# EAGLE design SPI_CAN_Converter (EAGLE 9.6.2)
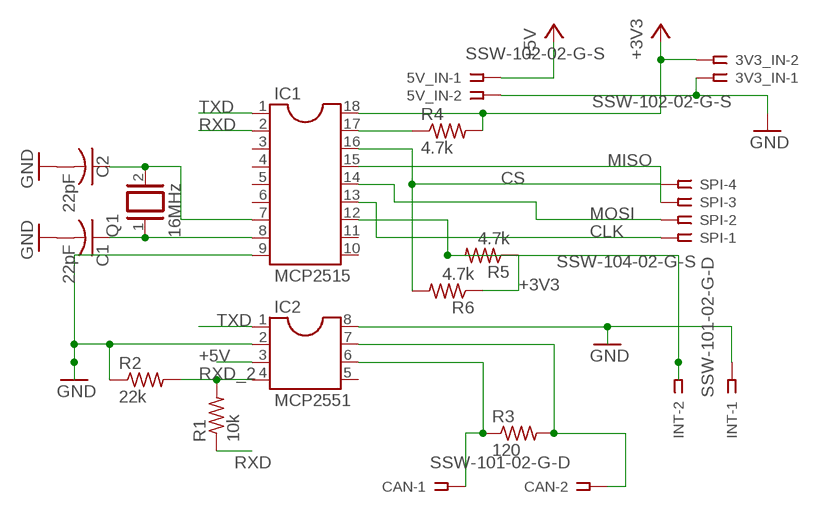
[diagram p0: schematic, sheet 1]

## Parts
3V3_IN  SSW-102-02-G-S  [SSW-102-02-G-S]
5V_IN  SSW-102-02-G-S  [SSW-102-02-G-S]
C1  22pF  C-US050-024X044  [C050-024X044]
C2  22pF  C-US050-024X044  [C050-024X044]
CAN  SSW-101-02-G-D  [SSW-101-02-G-D]
IC1  MCP2515  DIL18  [DIL18]
IC2  MCP2551  DIL8  [DIL08]
INT  SSW-101-02-G-D  [SSW-101-02-G-D]
Q1  16MHz  XTAL/S  [QS]
R1  10k  R-US_0207/7  [0207/7]
R2  22k  R-US_0207/7  [0207/7]
R3  120  R-US_0207/7  [0207/7]
R4  4.7k  R-US_0207/7  [0207/7]
R5  4.7k  R-US_0207/7  [0207/7]
R6  4.7k  R-US_0207/7  [0207/7]
SPI  SSW-104-02-G-S  [SSW-104-02-G-S]

## Nets
+3V3: 3V3_IN.2 IC1.18 R4.2 R5.1 R6.1
+5V: 5V_IN.1 IC2.3
CLK: IC1.13 SPI.1
CS: IC1.16 R6.2 SPI.4
GND: 3V3_IN.1 5V_IN.2 C1.2 C2.2 IC1.9 IC2.2 IC2.8 INT.1 R2.1
INT: IC1.12 INT.2 R5.2
MISO: IC1.15 SPI.3
MOSI: IC1.14 SPI.2
N$1: CAN.2 IC2.7 R3.2
N$2: CAN.1 IC2.6 R3.1
N$3: C1.1 IC1.8 Q1.1
N$4: C2.1 IC1.7 Q1.2
N$6: IC1.17 R4.1
RXD: IC1.2 R1.1
RXD_2: IC2.4 R1.2 R2.2
TXD: IC1.1 IC2.1
Unconnected: IC1.3 IC1.4 IC1.5 IC1.6 IC1.10 IC1.11 IC2.5

## Library data of the parts
3V3_IN 5V_IN = con-samtec:SSW-102-02-G-S: THROUGH-HOLE .025" SQ POST SOCKET Source: Samtec SSW.pdf; MF: Samtec Inc.; MPN: SSW-102-02-G-S; OC_FARNELL: unknown; OC_NEWARK: 11P9351
C1 C2 = rcl:C-US: CAPACITOR, American symbol; SPICEPREFIX: C
CAN INT = con-samtec:SSW-101-02-G: THROUGH-HOLE .025" SQ POST SOCKET Source: Samtec SSW.pdf; MF: Samtec Inc.; MPN: SSW-101-02-G-D; OC_FARNELL: unknown; OC_NEWARK: 82P1456
IC1 = ic-package:DIL18: Dual In Line / Socket
IC2 = ic-package:DIL8: Dual In Line / Socket
Q1 = special:XTAL/S: CRYSTAL
R1-R6 = rcl:R-US_: RESISTOR, American symbol; SPICEPREFIX: R
SPI = con-samtec:SSW-104-02-G-S: THROUGH-HOLE .025" SQ POST SOCKET Source: Samtec SSW.pdf; MF: Samtec Inc.; MPN: SSW-104-02-G-S; OC_FARNELL: unknown; OC_NEWARK: 11P9384

## Board
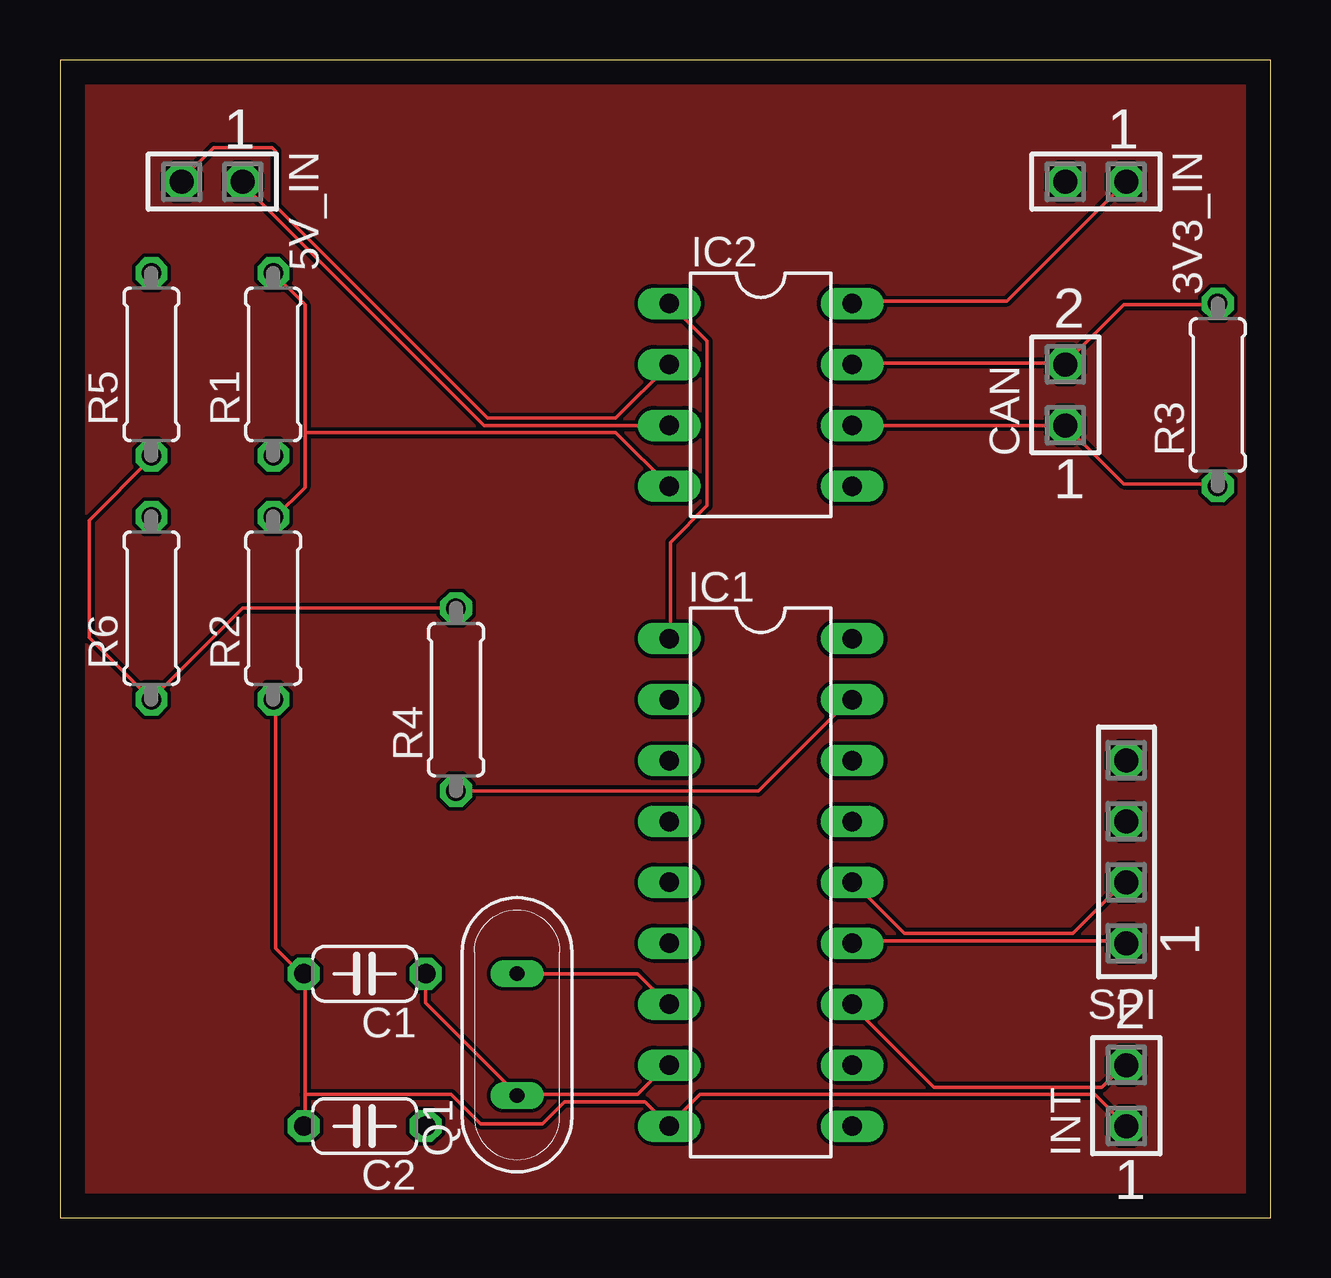
[diagram p1: board, top side]
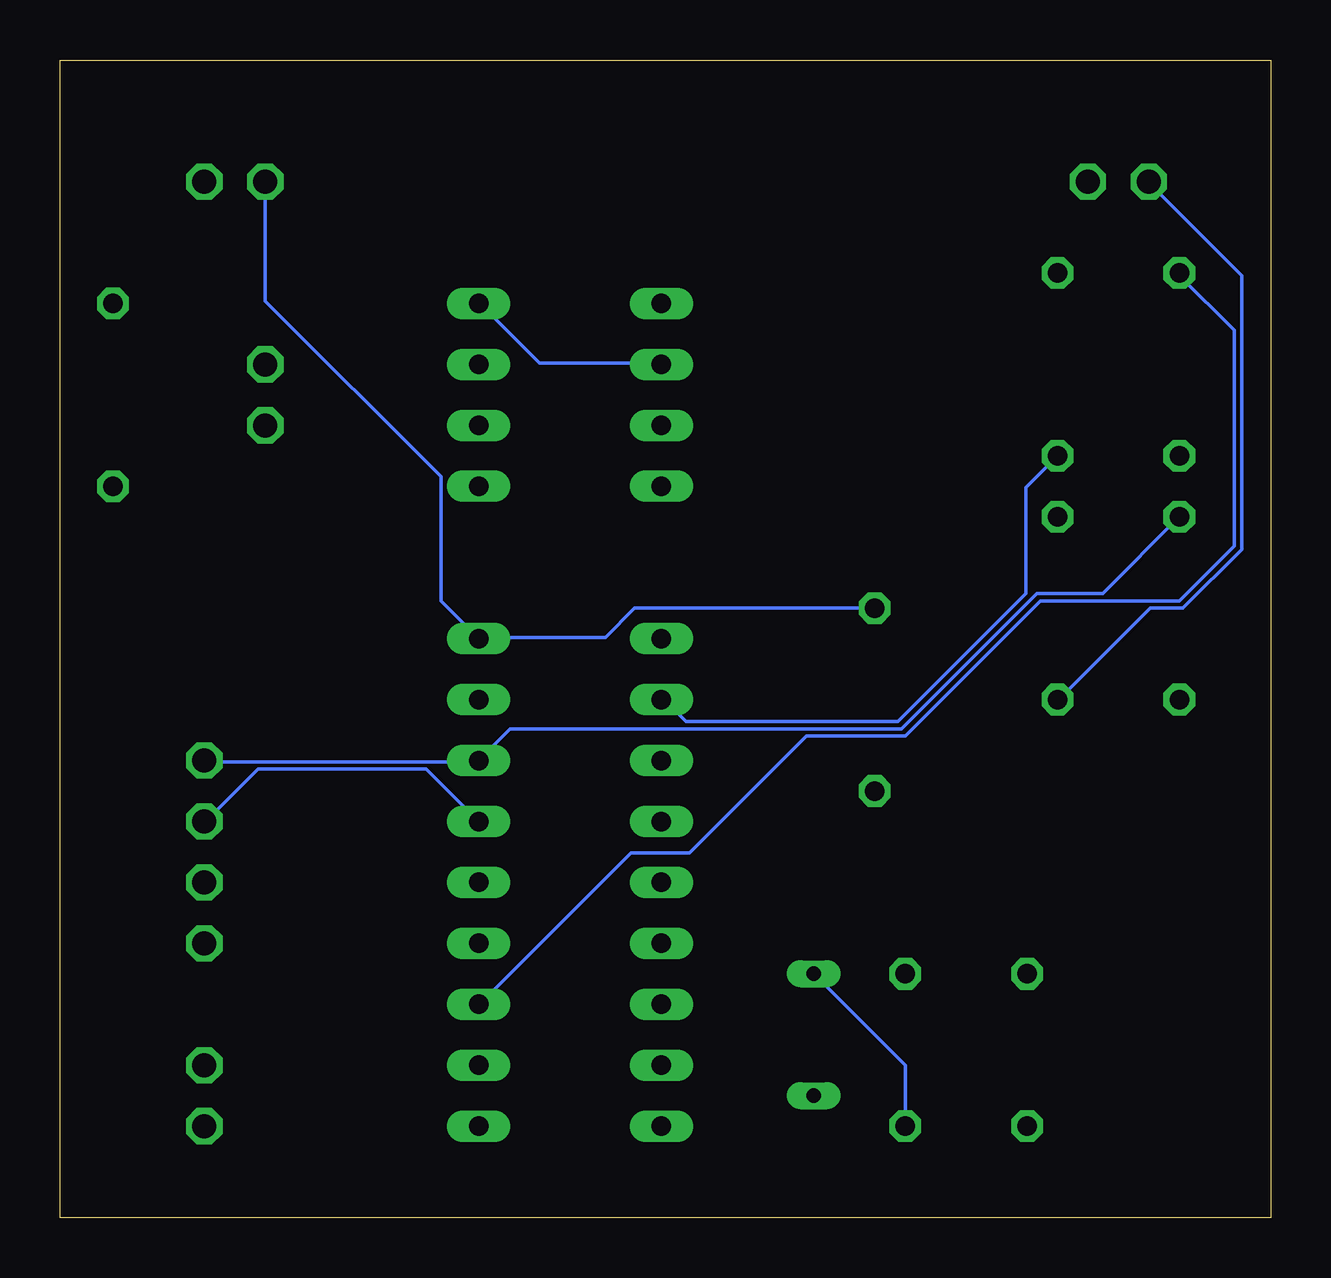
[diagram p2: board, bottom side, seen from below]

Size 50.47 x 48.25 mm. Coordinates in mm from the lower left corner, seen from the top.
Outline: 0,0 50.47,0 50.47,48.25 0,48.25 0,0
Copper layers (1*16): Top 0.035mm / dielectric 1.5mm / Bottom 0.035mm
Design rules "default": minimum track width 6mil, minimum drill 0.35mm, track to track 6mil, track to pad 6mil, pad to pad 6mil, via to via 6mil, smd to smd 6mil, copper to edge 40mil, drill to drill 6mil, minimum pad ring 10mil, minimum via ring 8mil, stop-mask expansion 4mil, vias tented up to drill 0mil, thermal gap 10mil

### Footprints (pad centres in the part's own frame; a part is rotated, then mirrored left to right if it is on the bottom)
SSW-102-02-G-S = drill 1 pad 1.5 octagon: 1 -1.27,0; 2 1.27,0
C050-024X044 = drill 0.813 octagon: 1 -2.54,0; 2 2.54,0
SSW-101-02-G-D = drill 1 pad 1.5 octagon: 1 0,-1.27; 2 0,1.27
DIL18 = drill 0.813 long: 1 -10.16,-3.81; 2 -7.62,-3.81; 3 -5.08,-3.81; 4 -2.54,-3.81; 5 0,-3.81; 6 2.54,-3.81; 7 5.08,-3.81; 8 7.62,-3.81; 9 10.16,-3.81; 10 10.16,3.81; 11 7.62,3.81; 12 5.08,3.81; 13 2.54,3.81; 14 0,3.81; 15 -2.54,3.81; 16 -5.08,3.81; 17 -7.62,3.81; 18 -10.16,3.81
DIL08 = drill 0.813 long: 1 -3.81,-3.81; 2 -1.27,-3.81; 3 1.27,-3.81; 4 3.81,-3.81; 5 3.81,3.81; 6 1.27,3.81; 7 -1.27,3.81; 8 -3.81,3.81
QS = drill 0.61 long: 1 -2.54,0; 2 2.54,0
0207/7 = drill 0.813 octagon: 1 -3.81,0; 2 3.81,0
SSW-104-02-G-S = drill 1 pad 1.5 octagon: 1 -3.81,0; 2 -1.27,0; 3 1.27,0; 4 3.81,0

### Placement (x,y rotation side)
3V3_IN  43.18,43.18 180 top
5V_IN  6.35,43.18 180 top
C1  12.7,10.16 180 top
C2  12.7,3.81 180 top
CAN  41.91,34.29 0 top
IC1  29.21,13.97 270 top
IC2  29.21,34.29 270 top
INT  44.45,5.08 0 top
Q1  19.05,7.62 90 top
R1  8.89,35.56 90 top
R2  8.89,25.4 90 top
R3  48.26,34.29 90 top
R4  16.51,21.59 90 top
R5  3.81,35.56 90 top
R6  3.81,25.4 90 top
SPI  44.45,15.24 90 top

### Tracks (layer width: path | path; a pad name or v marks a point on that pad's centre or on a via)
+3V3
  Top 0.152: R5.1 3.81,31.65 1.22,29.06 1.22,24.18 R6.1 7.62,25.4 R4.2
  Bottom 0.152: R4.2 26.52,25.4 27.74,24.18 32.92,24.18 IC1.18 34.59,25.7 34.59,30.89 41.91,38.2 3V3_IN.2
+5V
  Top 0.152: IC2.3 17.68,33.02 7.62,43.08 5V_IN.1
CLK
  Top 0.152: IC1.13 33.07,11.53 44.35,11.53 SPI.1
CS
  Bottom 0.152: SPI.4 44.35,19 33.07,19 IC1.16 31.7,20.37 15.39,20.37 9.75,26.01 7.01,26.01 R6.2
GND
  Top 0.152: 3V3_IN.1 39.47,38.2 33.07,38.2 IC2.8 | 10.21,5.13 10.21,10.16 C1.2 10.06,10.16 8.99,11.23 8.99,21.59 R2.1 | 10.21,5.13 10.21,3.91 C2.2 | 10.21,5.13 16.31,5.13 17.53,3.91 20.12,3.91 21.03,4.83 24.38,4.83 IC1.9 25.45,3.91 26.67,5.13 43.13,5.13 INT.1 | IC2.2 23.16,33.33 17.83,33.33 8.99,42.16 8.99,44.45 8.84,44.6 6.4,44.6 5.03,43.23 5V_IN.2
  Bottom 0.152: IC2.2 25.45,35.61 30.48,35.61 32.92,38.05 IC2.8 | 5V_IN.2 5.03,43.08 1.22,39.27 1.22,27.84 3.66,25.4 5.03,25.4 8.84,21.59 R2.1
INT
  Top 0.152: IC1.12 33.07,8.79 36.42,5.44 43.43,5.44 44.35,6.35 INT.2
  Bottom 0.152: R5.2 3.81,39.27 1.52,36.98 1.52,27.99 3.81,25.7 9.6,25.7 15.24,20.07 19.36,20.07 24.23,15.19 26.67,15.19 32.92,8.94 IC1.12
MISO
  Bottom 0.152: IC1.15 35.2,18.69 42.22,18.69 44.35,16.56 SPI.3
MOSI
  Top 0.152: IC1.14 33.07,13.97 35.2,11.84 42.22,11.84 44.35,13.97 SPI.2
N$1
  Top 0.152: 41.91,35.61 33.07,35.61 IC2.7 | 41.91,35.61 44.35,38.05 48.16,38.05 R3.2 | 41.91,35.61 CAN.2
N$2
  Top 0.152: R3.1 48.16,30.58 44.35,30.58 CAN.1 IC2.6
N$3
  Top 0.152: 19.05,5.13 24.08,5.13 25.3,6.35 IC1.8 | C1.1 15.24,8.94 19.05,5.13 | 19.05,5.13 Q1.1
N$4
  Top 0.152: Q1.2 24.08,10.16 25.3,8.94 IC1.7
  Bottom 0.152: C2.1 15.24,6.35 Q1.2
N$6
  Top 0.152: R4.1 29.11,17.78 32.92,21.59 IC1.17
POUR
  pour Top: 0,48.26 0,0 50.8,0 50.8,48.26
RXD
  Bottom 0.152: R1.1 10.21,30.43 10.21,26.01 15.54,20.68 24.38,20.68 25.3,21.59 IC1.2
RXD_2
  Top 0.152: 10.21,32.72 10.21,38.05 R1.2 | 10.21,32.72 10.21,30.43 8.99,29.21 R2.2 | IC2.4 23.16,32.72 10.21,32.72
TXD
  Top 0.152: IC2.1 26.98,36.52 26.98,29.67 25.45,28.14 25.45,24.18 IC1.1